# EAGLE design Adafruit Bicolor 8x8 HT16K33 STEMMA (EAGLE 9.6.2)
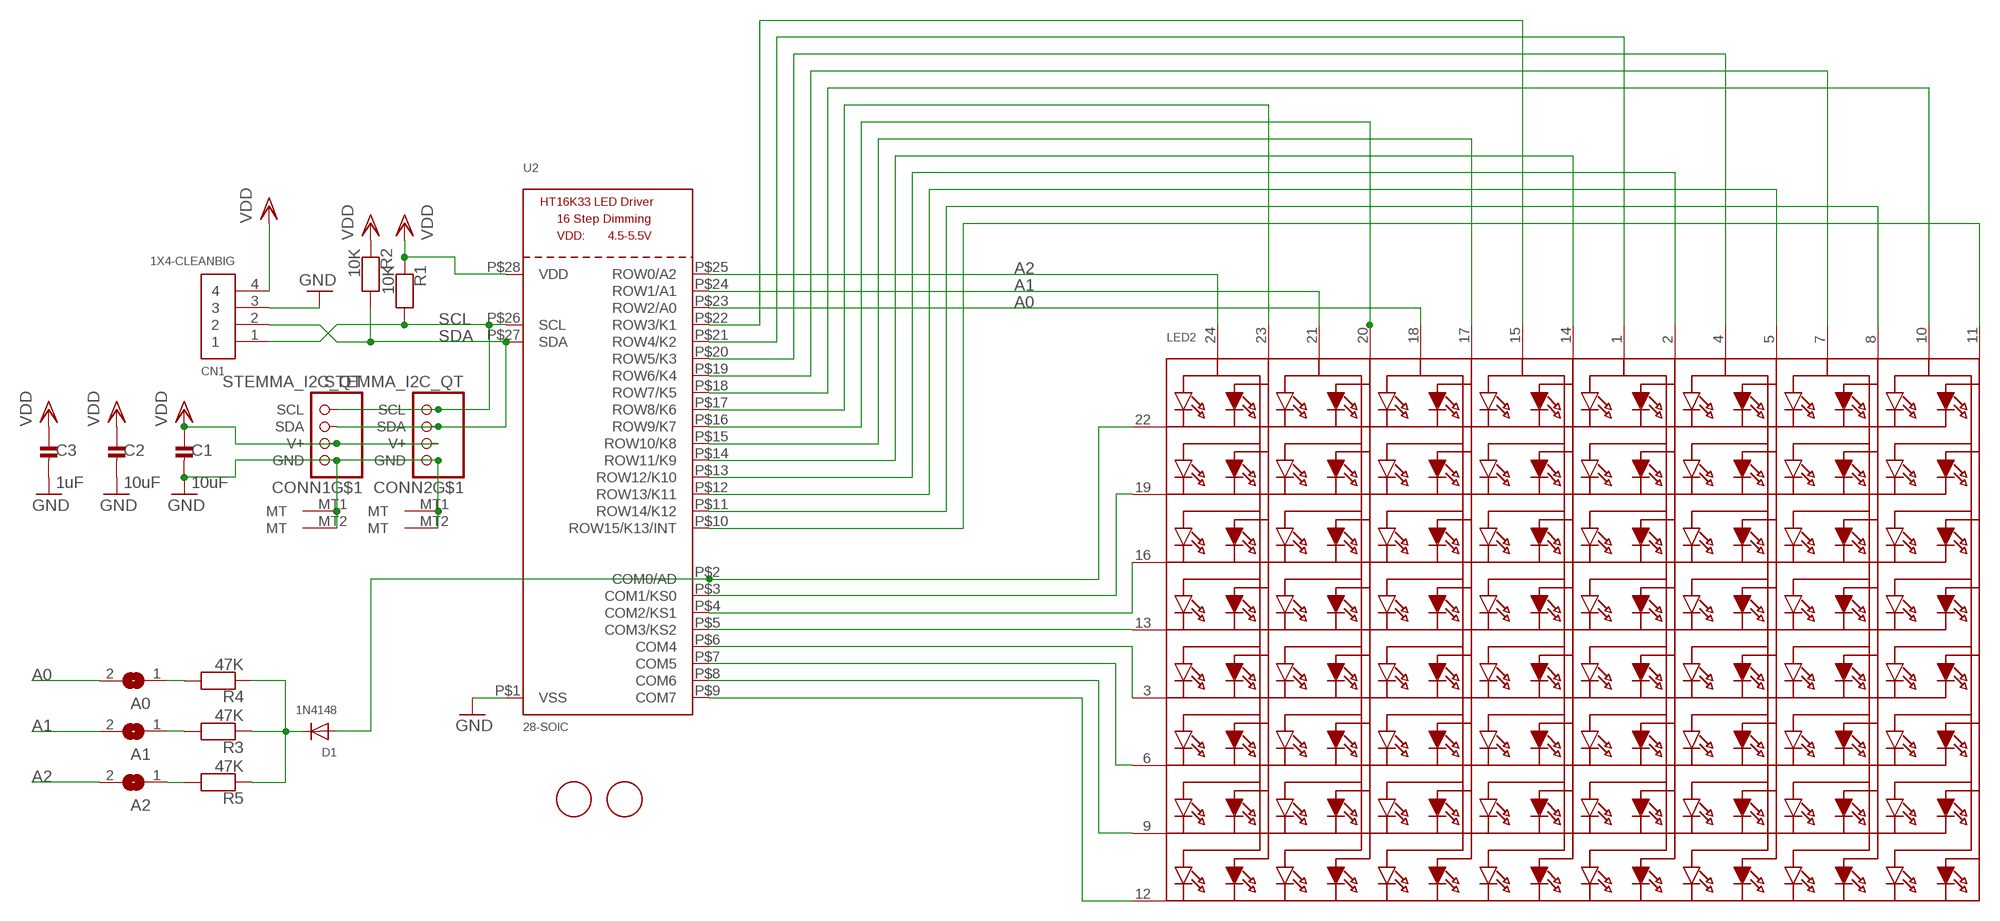
[diagram p0: schematic, sheet 1]

## Parts
A0  SOLDERJUMPERREFLOW_NOPASTE  [SOLDERJUMPER_REFLOW_NOPASTE]
A1  SOLDERJUMPERREFLOW_NOPASTE  [SOLDERJUMPER_REFLOW_NOPASTE]
A2  SOLDERJUMPERREFLOW_NOPASTE  [SOLDERJUMPER_REFLOW_NOPASTE]
C1  10uF  CAP_CERAMIC0805-NOOUTLINE  [0805-NO]
C2  10uF  CAP_CERAMIC0805-NOOUTLINE  [0805-NO]
C3  1uF  CAP_CERAMIC0603_NO  [0603-NO]
CN1  1X4-CLEANBIG  [1X04-CLEANBIG]
CONN1  STEMMA_I2C_QT  [JST_SH4]
CONN2  STEMMA_I2C_QT  [JST_SH4]
D1  1N4148  DIODESOD-323  [SOD-323]
LED2  DISP_SEGMENT_8X8_BICOLOR_ROWCATHODEMI2A883XX  [SEGMENT_BICOL_BL-M12A883XX]
R1  10K  RESISTOR_0603_NOOUT  [0603-NO]
R2  10K  RESISTOR_0603_NOOUT  [0603-NO]
R3  47K  RESISTOR_0603_NOOUT  [0603-NO]
R4  47K  RESISTOR_0603_NOOUT  [0603-NO]
R5  47K  RESISTOR_0603_NOOUT  [0603-NO]
U2  28-SOIC  HT16K33_SOP28  [SOP28_300MIL]
U$1  FIDUCIAL  [FIDUCIAL_1MM]
U$2  FIDUCIAL  [FIDUCIAL_1MM]

## Nets
A0: A0.2 LED2.18(A5) U2.P$23(ROW2/A0)
A1: A1.2 LED2.21(A3) U2.P$24(ROW1/A1)
A2: A2.2 LED2.24(A1) U2.P$25(ROW0/A2)
GND: C1.2 C2.2 C3.2 CN1.3 CONN1.1(GND) CONN1.MT1(MT) CONN1.MT2(MT) CONN2.1(GND) CONN2.MT1(MT) CONN2.MT2(MT) U2.P$1(VSS)
N$1: LED2.12(K8) U2.P$9(COM7)
N$2: LED2.9(K7) U2.P$8(COM6)
N$3: LED2.6(K6) U2.P$7(COM5)
N$4: LED2.3(K5) U2.P$6(COM4)
N$5: LED2.13(K4) U2.P$5(COM3/KS2)
N$6: LED2.16(K3) U2.P$4(COM2/KS1)
N$7: LED2.19(K2) U2.P$3(COM1/KS0)
N$8: D1.A LED2.22(K1) U2.P$2(COM0/AD)
N$9: A2.1 R5.2
N$10: LED2.8(A14) U2.P$11(ROW14/K12)
N$11: LED2.5(A12) U2.P$12(ROW13/K11)
N$12: LED2.11(A16) U2.P$10(ROW15/K13/INT)
N$16: D1.C R3.1 R4.1 R5.1
N$19: A1.1 R3.2
N$20: A0.1 R4.2
N$22: LED2.10(A15) U2.P$18(ROW7/K5)
N$23: LED2.7(A13) U2.P$19(ROW6/K4)
N$25: LED2.1(A9) U2.P$21(ROW4/K2)
N$26: LED2.15(A7) U2.P$22(ROW3/K1)
N$35: LED2.4(A11) U2.P$20(ROW5/K3)
N$38: LED2.23(A2) U2.P$17(ROW8/K6)
N$39: LED2.20(A4) U2.P$16(ROW9/K7)
N$40: LED2.14(A8) U2.P$14(ROW11/K9)
N$41: LED2.17(A6) U2.P$15(ROW10/K8)
N$42: LED2.2(A10) U2.P$13(ROW12/K10)
SCL: CN1.1 CONN1.4(SCL) CONN2.4(SCL) R1.2 U2.P$26(SCL)
SDA: CN1.2 CONN1.3(SDA) CONN2.3(SDA) R2.2 U2.P$27(SDA)
VDD: C1.1 C2.1 C3.1 CN1.4 CONN1.2(V+) CONN2.2(V+) R1.1 R2.1 U2.P$28(VDD)

## Library data of the parts
A0 A1 A2 = microbuilder:SOLDERJUMPER: SMD Solder JUMPER Solder the two pads together to create a connection, or remove the solder to break it. REFLOW - Use this footprint for solder paste and reflow ovens. WAVE - Use this footprint for hand-soldering (larger pads). CLOSED - Has a trace between the two pads to ensure it is closed by default. The trace needs to be cut to disable the jumper, and can be closed again by creating a solder bridge between the two pads.
C1-C3 = microbuilder:CAP_CERAMIC: Ceramic Capacitors For new designs, use the packages preceded by an '_' character since they are more reliable: The following footprints should be used on most boards: _0402 - Standard footprint for regular board layouts _0603 - Standard footprint for regular board layouts _0805 - Standard footprint for regular board layouts _1206 - Standard footprint for regular board layouts For extremely tight-pitch boards where space is at a premium, the following 'micro-pitch' footprints can be used (smaller pads, no silkscreen outline, etc.): _0402MP - Micro-pitch footprint for very dense/compact boards _0603MP - Micro-pitch footprint for very dense/compact boards _0805MP - Micro-pitch footprint for very dense/compact boards _1206MP - Micro-pitch footprint for very dense/compact boards
CN1 = adafruit:1X4: 4-pin connector
CONN1 CONN2 = adafruit_electromech:STEMMA_I2C; LCSC: C2845363
D1 = microbuilder:DIODE: Diode SMA Model Volts Amps Type Vf Ir Digikey # Notes SSA34-E3 40V 3A Schottky 480mV @ 3A 200uA @ 40V SSA34-E3/61TGITR-ND CDBA120-G 20V 1A Schottky 500mV @ 1A 500uA @ 20V 641-1014-6-ND REEL MBRA210 10V 2A Schottky 350mV @ 2A 700uA @ 10V MBRA210LT3 SOD-123 Model Volts Amps Type Vf Ir Order # Notes BAT54T1G 30V 200mA Schottky 800mV @ 200mA 2uA @ 25V BAT54T1GOSTR-ND B0530W 30V 500mA Schottky 430mV @ 500mA 130uA @ 30V B0530W-FDICT-ND REEL MBR120 20V 1A Schottky 340mV @ 1A MBR120VLSFT1GOSCT-ND SOD-323 Model Volts Amps Type Vf Ir Order # Notes PMEG2005EJ 20V 500mA Schottky 355mV @ 500mA 568-4110-1-ND ZLLS410 10V 570mA Schottky 380mV @ 570mA ZLLS410CT-ND 1N4148WS 75V 150mA Silicon/Simple 1V 1N4148WSFSCT-ND REEL SOD-523 Model Volts Amps Type Vf Ir Order # Notes BAT54XV2 30V 200mA Schottky 0.8V @ 100mA BAT54XV2CT-ND TB751S 30V 30mA Schottky RB751S-40TE61CT-ND SOT23-R/W (R = Solder Paste/Reflow Ovens, W = Hand-Soldering) Model Volts Amps Type Vf Ir Order # Notes BAT54FILM 40V 300mA Schottky 497-7162-1-ND POWERDI-5 Model Volts Amps Type Vf Ir Order # Notes PDS560 60V 5A Schottky 670mV @ 5A 150uA @ 60V PDS560DICT-ND
LED2 = adafruit_display:DISP_SEGMENT_8X8_BICOLOR_ROWCATHODE: 8x8 Bi-Color LED Segment Displays: Row = Cathode 1.2" Bi-Color 8x8 Matrix, 3.0mm Square LEDs - BL-M12A883XX
R1-R5 = microbuilder:RESISTOR: Resistors For new designs, use the packages preceded by an '_' character since they are more reliable: The following footprints should be used on most boards: _0402 - Standard footprint for regular board layouts _0603 - Standard footprint for regular board layouts _0805 - Standard footprint for regular board layouts _1206 - Standard footprint for regular board layouts For extremely tight-pitch boards where space is at a premium, the following 'micro-pitch' footprints can be used (smaller pads, no silkscreen outline, etc.): _0402MP - Micro-pitch footprint for very dense/compact boards _0603MP - Micro-pitch footprint for very dense/compact boards _0805MP - Micro-pitch footprint for very dense/compact boards _1206MP - Micro-pitch footprint for very dense/compact boards
U2 = adafruit_display:HT16K33_SOP28
U$1 U$2 = adafruit:FIDUCIAL: For use by pick and place machines to calibrate the vision/machine, 1mm By microbuilder.eu

## Board
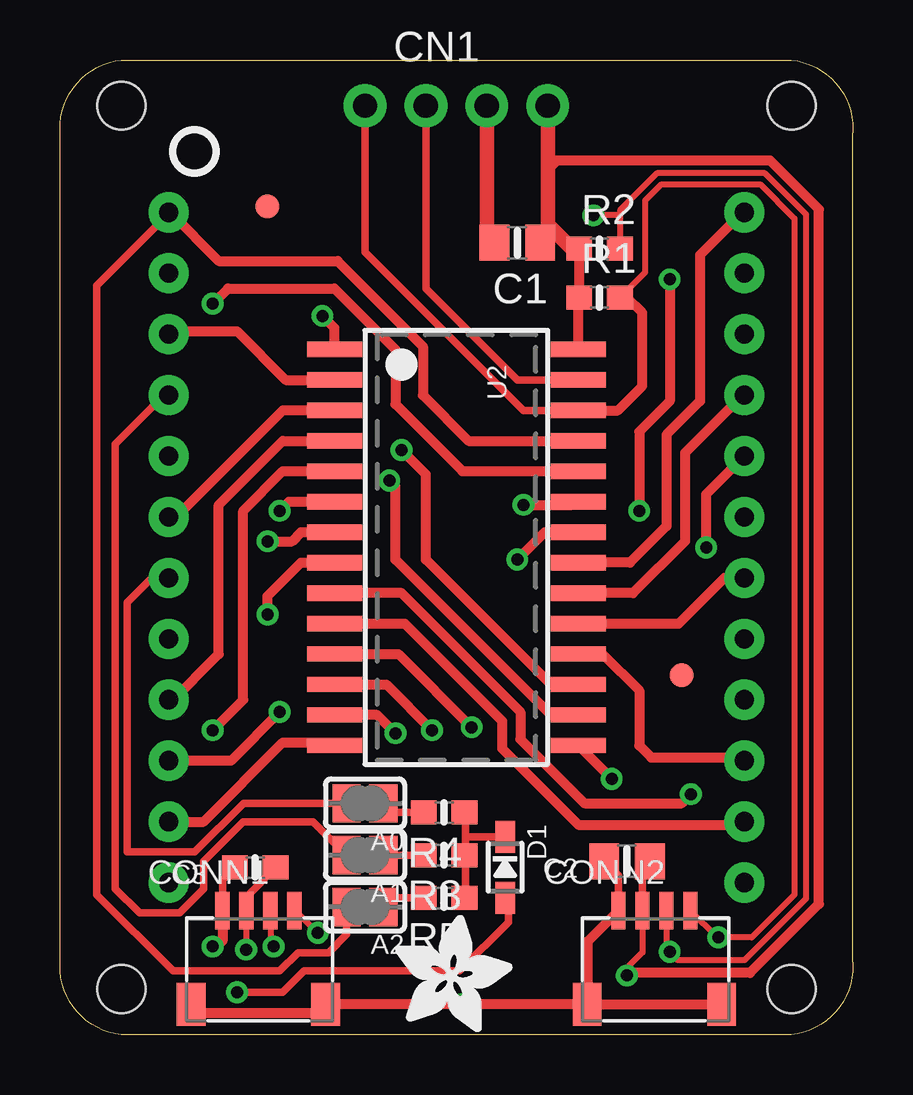
[diagram p1: board, top side]
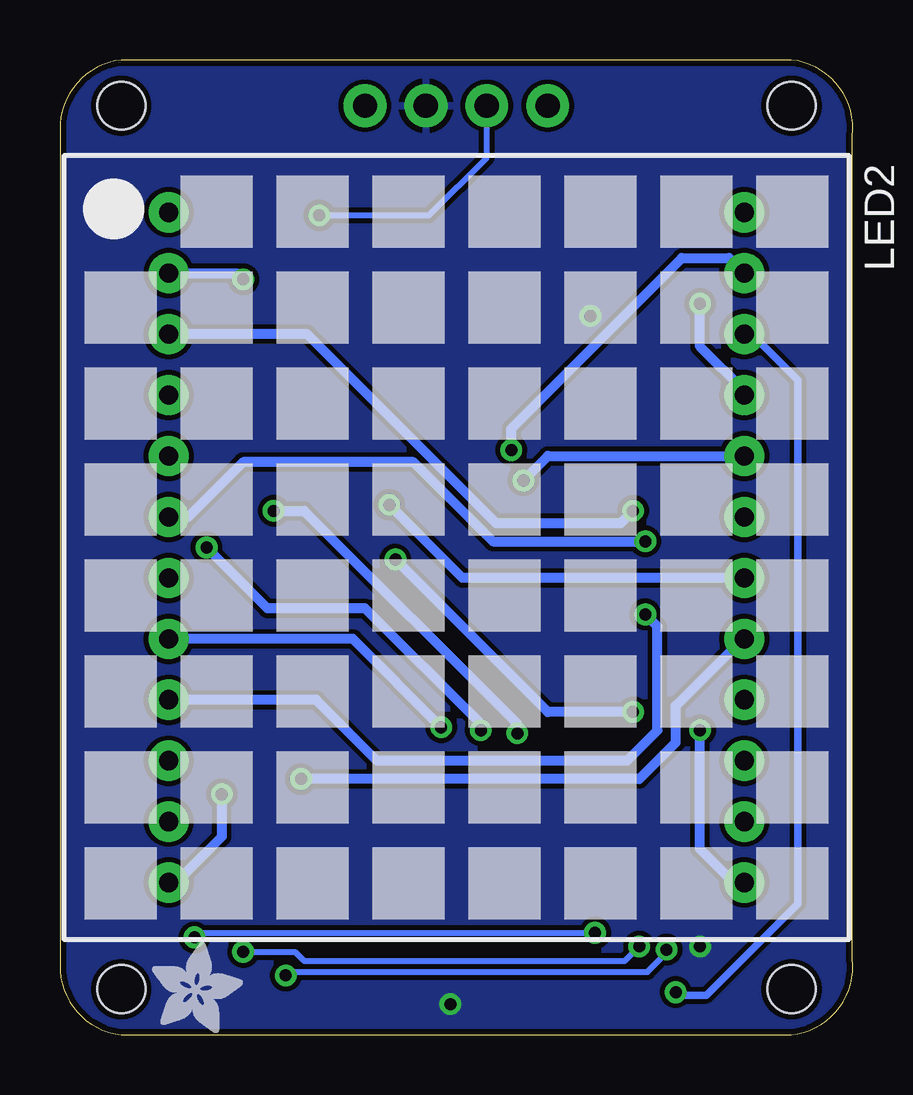
[diagram p2: board, bottom side, seen from below]

Size 33.05 x 40.64 mm. Coordinates in mm from the lower left corner, seen from the top.
Outline: 2.56,0 arc-90 0.02,3.17 0.02,37.47 arc-90 2.56,40.64 30.5,40.64 arc-90 33.04,37.47 33.04,3.17 arc-90 30.5,0 2.56,0
Copper layers (1*16): Top 0.035mm / dielectric 1.5mm / Bottom 0.035mm
Design rules "adafruit 88": minimum track width 8mil, minimum drill 15.5mil, track to track 8mil, track to pad 8mil, pad to pad 8mil, via to via 8mil, smd to smd 8mil, copper to edge 10mil, drill to drill 8mil, minimum pad ring 10mil, minimum via ring 8mil, stop-mask expansion 2mil, vias tented up to drill 20mil, thermal gap 10mil
Holes 2 mm at 30.5,1.91 30.5,38.73 2.56,1.91 2.56,38.73

### Footprints (pad centres in the part's own frame; a part is rotated, then mirrored left to right if it is on the bottom)
SOLDERJUMPER_REFLOW_NOPASTE = smd 1.168 x 1.6: 1 -0.762,0; 2 0.762,0
0805-NO = smd 1.24 x 1.5: 1 -0.95,0; 2 0.95,0
0603-NO = smd 1.075 x 1: 1 -0.85,0; 2 0.85,0
1X04-CLEANBIG = drill 1.016 pad 1.778: 1 -3.81,0; 2 -1.27,0; 3 1.27,0; 4 3.81,0
JST_SH4 = smd 0.6 x 1.55: 1 -1.5,2.006; 2 -0.5,2.006; 3 0.5,2.006; 4 1.5,2.006 | smd 1.2 x 1.8: MT1 -2.8,-1.894; MT2 2.8,-1.894
SOD-323 = smd 1.35 x 0.8: A 1.27,0; C -1.27,0
SEGMENT_BICOL_BL-M12A883XX = drill 0.8 pad 1.676: 1 -13.97,-12; 2 -11.43,-12; 3 -8.89,-12; 4 -6.35,-12; 5 -3.81,-12; 6 -1.27,-12; 7 1.27,-12; 8 3.81,-12; 9 6.35,-12; 10 8.89,-12; 11 11.43,-12; 12 13.97,-12; 13 13.97,12; 14 11.43,12; 15 8.89,12; 16 6.35,12; 17 3.81,12; 18 1.27,12; 19 -1.27,12; 20 -3.81,12; 21 -6.35,12; 22 -8.89,12; 23 -11.43,12; 24 -13.97,12
SOP28_300MIL = smd 0.635 x 2.286: P$1 -8.255,-5.08; P$2 -6.985,-5.08; P$3 -5.715,-5.08; P$4 -4.445,-5.08; P$5 -3.175,-5.08; P$6 -1.905,-5.08; P$7 -0.635,-5.08; P$8 0.635,-5.08; P$9 1.905,-5.08; P$10 3.175,-5.08; P$11 4.445,-5.08; P$12 5.715,-5.08; P$13 6.985,-5.08; P$14 8.255,-5.08; P$15 8.255,5.08; P$16 6.985,5.08; P$17 5.715,5.08; P$18 4.445,5.08; P$19 3.175,5.08; P$20 1.905,5.08; P$21 0.635,5.08; P$22 -0.635,5.08; P$23 -1.905,5.08; P$24 -3.175,5.08; P$25 -4.445,5.08; P$26 -5.715,5.08; P$27 -6.985,5.08; P$28 -8.255,5.08
FIDUCIAL_1MM = smd 1 x 1: 1 0,0

### Placement (x,y rotation side)
A0  12.72,9.65 180 top
A1  12.72,7.49 180 top
A2  12.72,5.33 180 top
C1  19.07,33.02 180 top
C2  23.64,7.24 180 top
C3  8.15,6.99 180 top
CN1  16.53,38.73 0 top
CONN1  8.27,3.17 0 top
CONN2  24.78,3.17 0 top
D1  18.56,6.99 270 top
E$2  [ADAFRUIT_3.5MM]  29.23,0.06 0 bottom
LED2  16.53,20.32 270 bottom
PLABEL0  [PLABEL0]  15.7,34.92 90 top
PLABEL1  [PLABEL1]  13.16,35.05 90 top
PLABEL2  [PLABEL2]  20.91,34.92 90 top
PLABEL3  [PLABEL3]  18.37,34.8 90 top
PLABEL4  [PLABEL4]  7.51,13.72 90 top
PLABEL5  [PLABEL5]  2.05,20.57 90 top
PLABEL6  [PLABEL6]  10.81,9.02 90 top
PLABEL7  [PLABEL7]  10.81,6.73 90 top
PLABEL8  [PLABEL8]  11.83,3.05 0 top
PLABEL9  [PLABEL9]  31.39,20.7 90 top
PLABEL10  [PLABEL10]  14.69,1.91 0 bottom
PLABEL11  [PLABEL11]  12.08,37.02 0 bottom
PLABEL12  [PLABEL12]  16.27,36.96 0 bottom
PLABEL13  [PLABEL13]  19.07,36.96 0 bottom
PLABEL14  [PLABEL14]  23.51,36.89 0 bottom
R1  22.5,30.73 0 top
R2  22.5,32.77 0 top
R3  16.02,7.49 180 top
R4  16.02,9.27 180 top
R5  16.02,5.71 180 top
U2  16.53,20.32 270 top
U$1  8.65,34.54 90 top
U$2  25.93,14.99 90 top
U$3  [ADAFRUIT_5MM]  13.99,0.13 0 top
U$4  [PCBFEAT-REV-040]  5.61,36.83 90 top

### Tracks (layer width: path | path; a pad name or v marks a point on that pad's centre or on a via)
A0  (via drill 0.5)
  Top 0.305: LED2.18 3.83,19.05 2.81,18.03 2.81,7.62 5.62,7.62 7.65,9.65 A0.2
  Top 0.406: U2.P$23 21.61,22.35 21.35,22.1 v19.32,22.1
  Bottom 0.406: LED2.18 16.27,19.05 v19.32,22.1
A1  (via drill 0.5)
  Top 0.305: LED2.21 4.34,26.67 2.3,24.64 2.3,6.1 3.32,5.08 4.99,5.08 5.99,6.08 5.99,7.24 7.64,8.89 10.56,8.89 A1.2
  Top 0.406: U2.P$24 16.78,23.5 13.99,26.29 13.99,28.57 11.45,31.11 7,31.11 v6.37,30.48
  Bottom 0.406: v6.37,30.48 6.37,28.7 4.53,26.86 LED2.21
A2
  Top 0.305: 4.59,34.29 1.54,31.24 1.54,5.84 4.72,2.67 9.16,2.67 9.92,3.43 11.19,3.43 11.96,4.19 A2.2
  Top 0.406: U2.P$25 17.04,24.77 15.13,26.67 15.13,28.7 11.57,32.26 6.62,32.26 4.59,34.29 LED2.24
GND  (via drill 0.5)
  Top 0.305: C3.2 6.77,6.46 CONN1.1 | CONN2.1 23.28,6.65 C2.2
  Top 0.406: U2.P$1 11.45,29.46 v10.94,29.97 | CONN2.1 21.98,3.88 CONN2.MT1 | CONN2.MT1 CONN2.MT2 | CONN1.MT1 5.85,0.9 10.69,0.9 CONN1.MT2 v16.78,1.28 CONN2.MT1 | v6.37,3.68 6.54,3.68 6.77,3.91 CONN1.1
  Top 0.61: C1.2 17.8,33.34 CN1.3
  pour Bottom: 0.02,0 0.02,40.64 33.04,40.64 33.04,0
N$1  (via drill 0.5)
  Top 0.406: U2.P$9 14.24,18.41 19.19,13.46 19.19,12.32 21.86,9.65 25.93,9.65 v26.31,10.03
  Bottom 0.406: LED2.12 28.21,6.35 26.31,8.26 v26.31,10.03
N$2  (via drill 0.5)
  Top 0.406: U2.P$8 10.05,19.68 8.65,18.29 v8.65,17.53
  Bottom 0.406: LED2.9 22.37,13.97 19.83,11.43 9.42,11.43 8.15,12.7 8.15,17.02 v8.65,17.53
N$3  (via drill 0.5)
  Top 0.406: U2.P$7 10.05,20.95 9.67,20.57 v8.65,20.57
  Bottom 0.406: v8.65,20.57 15,20.57 18.31,23.88 25.42,23.88 27.7,21.59 LED2.6
N$4  (via drill 0.5)
  Top 0.406: U2.P$6 9.54,22.23 v9.16,21.84
  Bottom 0.406: v9.16,21.84 9.67,21.34 14.88,21.34 22.75,29.21 LED2.3
N$5  (via drill 0.5)
  Top 0.406: U2.P$5 9.29,23.5 7.64,21.84 7.64,13.97 v6.37,12.7
  Bottom 0.406: LED2.13 4.72,6.35 4.84,6.22 6.37,7.75 v6.37,12.7
N$6
  Top 0.406: U2.P$4 9.29,24.77 6.62,22.1 6.62,15.88 4.59,13.84 4.53,13.9 LED2.16
N$7
  Top 0.406: U2.P$3 9.29,26.04 4.84,21.59 LED2.19
N$8  (via drill 0.5)
  Top 0.305: D1.A 18.69,5.58 18.69,4.7 16.66,2.67 10.18,2.67 9.29,1.78 v7.38,1.78
  Top 0.406: U2.P$2 9.42,27.3 7.38,29.34 4.59,29.34 4.59,29.27 LED2.22
  Bottom 0.305: v7.38,1.78 7.26,1.65 6.11,1.65 2.3,5.46 2.3,27.3 4.21,29.21 LED2.22
N$9
  Top 0.305: R5.2 13.86,5.71 A2.1
N$10  (via drill 0.5)
  Top 0.406: U2.P$11 14.11,15.88 v17.16,12.83
  Bottom 0.406: v17.16,12.83 20.85,16.51 LED2.8
N$11  (via drill 0.5)
  Top 0.406: U2.P$12 13.61,14.61 v15.51,12.7 | LED2.5 26.94,22.54 v26.94,20.32
  Bottom 0.406: v26.94,20.32 24.4,17.78 20.34,17.78 15.51,12.95 v15.51,12.7
N$12
  Top 0.406: U2.P$10 14.37,17.14 18.43,13.08 18.43,11.94 21.61,8.76 28.4,8.76 LED2.11
N$16
  Top 0.305: R4.1 16.91,9.27 16.91,7.52 R3.1 16.91,7.49 | R5.1 16.91,5.75 16.91,7.49 | 16.91,7.49 16.91,8.26 D1.C
N$19
  Top 0.305: A1.1 R3.2
N$20
  Top 0.305: R4.2 13.86,9.27 A0.1
N$22
  Top 0.406: U2.P$18 22.62,15.88 24.15,14.35 24.15,12.06 24.66,11.56 28.59,11.56 28.53,11.49 LED2.10
N$23
  Top 0.406: U2.P$19 25.8,17.14 27.7,19.05 28.34,19.05 28.47,19.18 28.53,19.11 LED2.7
N$25
  Top 0.406: U2.P$21 23.77,19.68 25.29,21.21 25.29,25.02 26.69,26.42 26.69,32.51 28.47,34.29 LED2.1
N$26  (via drill 0.5)
  Top 0.406: U2.P$22 20.21,20.95 v19.07,19.81 | v9.16,13.46 7.13,11.43 LED2.15
  Bottom 0.406: v19.07,19.81 12.72,13.46 v9.16,13.46
N$35
  Top 0.406: U2.P$20 23.89,18.41 26.05,20.57 26.05,24.26 28.47,26.67 LED2.4
N$38  (via drill 0.5)
  Top 0.406: U2.P$17 20.46,14.61 15.26,19.81 15.26,23.37 v14.24,24.38
  Bottom 0.406: v14.24,24.38 14.24,25.27 7.13,32.38 5.16,32.38 LED2.23
N$39  (via drill 0.5)
  Top 0.406: U2.P$16 20.46,13.34 13.99,19.81 13.99,22.86 v13.73,23.11
  Bottom 0.406: v13.73,23.11 12.72,24.13 LED2.20
N$40
  Top 0.406: LED2.14 5.99,8.89 9.29,12.19 11.45,12.19 U2.P$14
N$41  (via drill 0.5)
  Top 0.406: v23,10.67 U2.P$15
  Bottom 0.406: v23,10.67 8.91,10.67 7.38,12.19 7.38,13.72 4.59,16.51 LED2.17
N$42  (via drill 0.5)
  Top 0.406: U2.P$13 13.23,13.34 v13.99,12.57 | v25.42,31.5 25.42,26.42 24.15,25.15 v24.15,21.84
  Bottom 0.406: v13.99,12.57 13.99,12.95 22.88,21.84 v24.15,21.84 | v25.42,31.5 25.67,31.75 LED2.2
SCL  (via drill 0.5)
  Top 0.254: v10.75,4.25 9.82,5.18 CONN1.4 | CONN2.4 27.4,4.06 v27.45,4.06 28.84,4.06 30.62,5.84 30.62,34.03 29.2,35.46 25.07,35.46 24.4,34.79 24.4,31.79 R1.2
  Top 0.305: CN1.1 12.72,32.64 19.32,26.04 U2.P$26
  Top 0.406: U2.P$26 23.26,26.04 24.27,27.05 24.27,30.1 23.64,30.73 R1.2
  Bottom 0.254: v27.45,4.06 27.26,4.25 v10.75,4.25
SDA  (via drill 0.5)
  Top 0.254: CONN2.3 25.28,3.6 v25.42,3.46 25.76,3.12 28.55,3.12 31.11,5.68 31.11,34.2 29.39,35.92 24.88,35.92 23.35,34.38 23.35,34.16 | v8.91,3.68 8.77,3.82 CONN1.3 | 23.35,34.16 R2.2 | 23.35,34.16 v22.24,34.16
  Top 0.305: CN1.2 15.26,31.11 19.07,27.3 U2.P$27
  Bottom 0.254: v8.91,3.68 9.51,3.08 22.88,3.08 23.26,3.46 v25.42,3.46 | v22.24,34.16 17.67,34.16 15.26,36.58 CN1.2
VDD  (via drill 0.5)
  Top 0.254: CONN2.2 24.28,3.44 23.64,2.79 v23.64,2.48 | CONN1.2 7.76,5.17 v7.76,3.56
  Top 0.305: CONN1.2 7.77,5.76 C3.1 | CONN2.2 24.28,6.93 C2.1
  Top 0.406: U2.P$28 21.61,30.73 R1.1 21.65,32.47 | 21.35,32.77 R2.1 | v23.64,2.48 23.75,2.59 28.77,2.59 31.64,5.46 31.64,34.42 29.61,36.45 20.72,36.45 20.34,36.07
  Top 0.61: 20.34,33.78 21.35,32.77 21.65,32.47 | 20.34,33.78 20.34,33.34 C1.1 | 20.34,33.78 20.34,36.07 CN1.4
  Bottom 0.254: v23.64,2.48 23.49,2.62 8.56,2.62 7.76,3.42 v7.76,3.56

### Text on the board
bDocu: C | D | - | +
Pinguin_tBackup: SCL | SDA | GND | VCC | HT16K33 LED Backpack | 8x8 Bi-Color LED Matrix | from adafruit! | A0 | A1 | A2
Pinguin_bBackup: VCC | SCL | SDA | GND | 8x8 Bi-Color LED Matrix